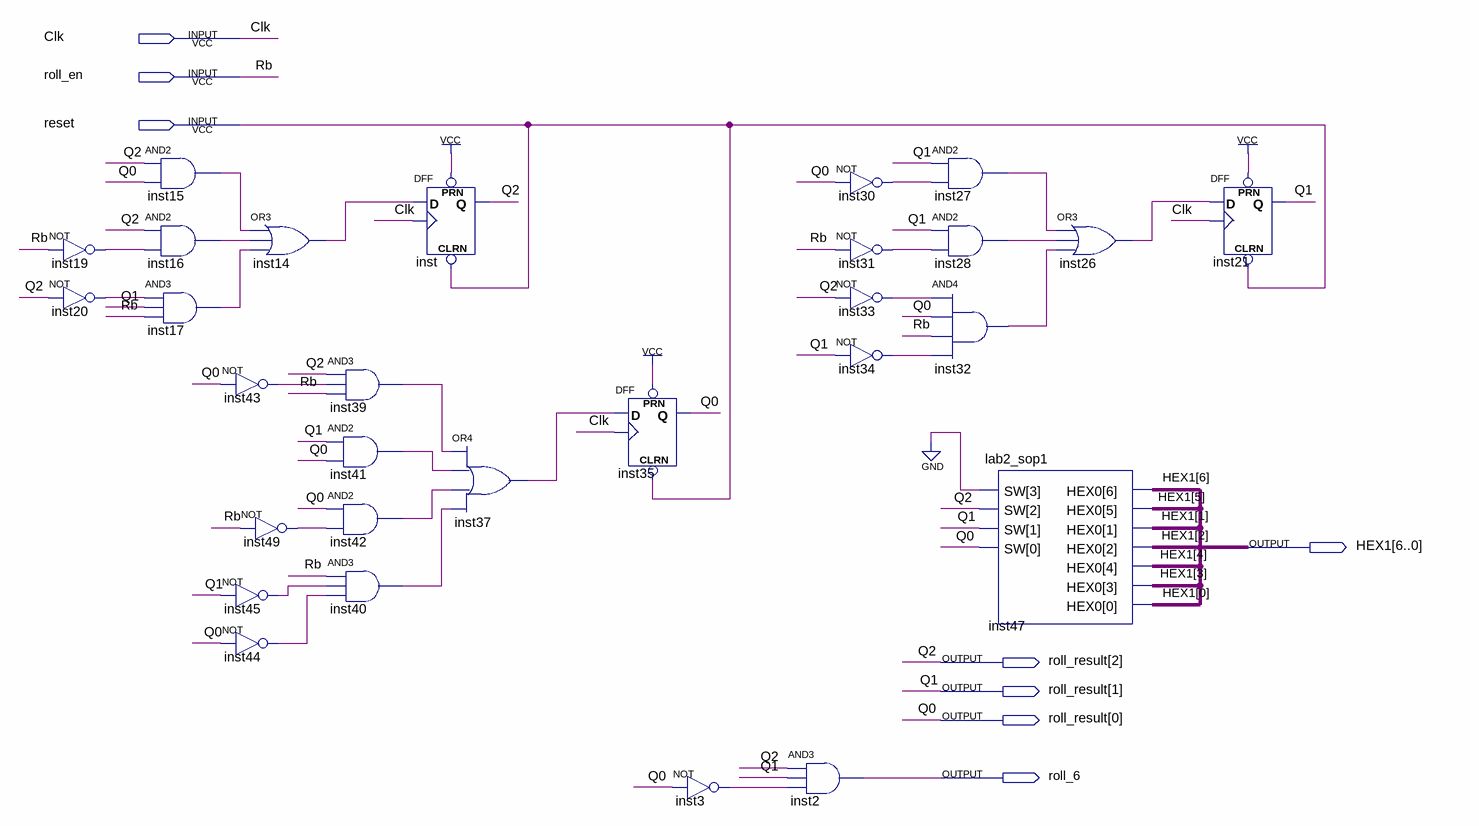
[diagram p0: schematic sheet]
// Quartus schematic Moore.bdf as structural Verilog: 29 symbols, 8 pins
module Moore (
  input  Clk,
  input  roll_en,
  input  reset,
  output [6:0] HEX1,
  output [2:0] roll_result,
  output roll_6
);

  wire inst3_out, inst14_out, inst15_out, inst16_out, inst17_out, inst19_out, inst20_out, inst26_out,
       inst27_out, inst28_out, inst30_out, inst31_out, inst32_out, inst33_out, inst34_out, inst37_out,
       inst39_out, inst40_out, inst41_out, inst42_out, inst43_out, inst44_out, inst45_out, inst49_out;

  not inst19 (inst19_out, roll_en);
  not inst20 (inst20_out, roll_result[2]);
  and inst15 (inst15_out, roll_result[2], roll_result[0]);
  and inst16 (inst16_out, roll_result[2], inst19_out);
  and inst17 (inst17_out, inst20_out, roll_result[1], roll_en);
  not inst43 (inst43_out, roll_result[0]);
  not inst49 (inst49_out, roll_en);
  not inst45 (inst45_out, roll_result[1]);
  not inst44 (inst44_out, roll_result[0]);
  or inst14 (inst14_out, inst15_out, inst16_out, inst17_out);
  and inst39 (inst39_out, roll_result[2], inst43_out, roll_en);
  and inst41 (inst41_out, roll_result[1], roll_result[0]);
  and inst42 (inst42_out, roll_result[0], inst49_out);
  and inst40 (inst40_out, roll_en, inst45_out, inst44_out);
  DFF inst (.CLRN(reset), .CLK(Clk), .D(inst14_out), .PRN(1'b1), .Q(roll_result[2]));
  or inst37 (inst37_out, inst39_out, inst41_out, inst42_out, inst40_out);
  DFF inst35 (.CLRN(reset), .CLK(Clk), .D(inst37_out), .PRN(1'b1), .Q(roll_result[0]));
  not inst3 (inst3_out, roll_result[0]);
  not inst30 (inst30_out, roll_result[0]);
  not inst31 (inst31_out, roll_en);
  not inst33 (inst33_out, roll_result[2]);
  not inst34 (inst34_out, roll_result[1]);
  and inst2 (roll_6, roll_result[2], roll_result[1], inst3_out);
  and inst27 (inst27_out, roll_result[1], inst30_out);
  and inst28 (inst28_out, roll_result[1], inst31_out);
  and inst32 (inst32_out, inst33_out, roll_result[0], roll_en, inst34_out);
  lab2_sop1 inst47 (.SW({1'b0, roll_result}), .HEX0(HEX1));
  or inst26 (inst26_out, inst27_out, inst28_out, inst32_out);
  DFF inst21 (.CLRN(reset), .CLK(Clk), .D(inst26_out), .PRN(1'b1), .Q(roll_result[1]));

  // Other names for the same wires on the sheet: Q0 = roll_result[0]; Q1 = roll_result[1]; Q2 = roll_result[2];
  //   Rb = roll_en
endmodule
